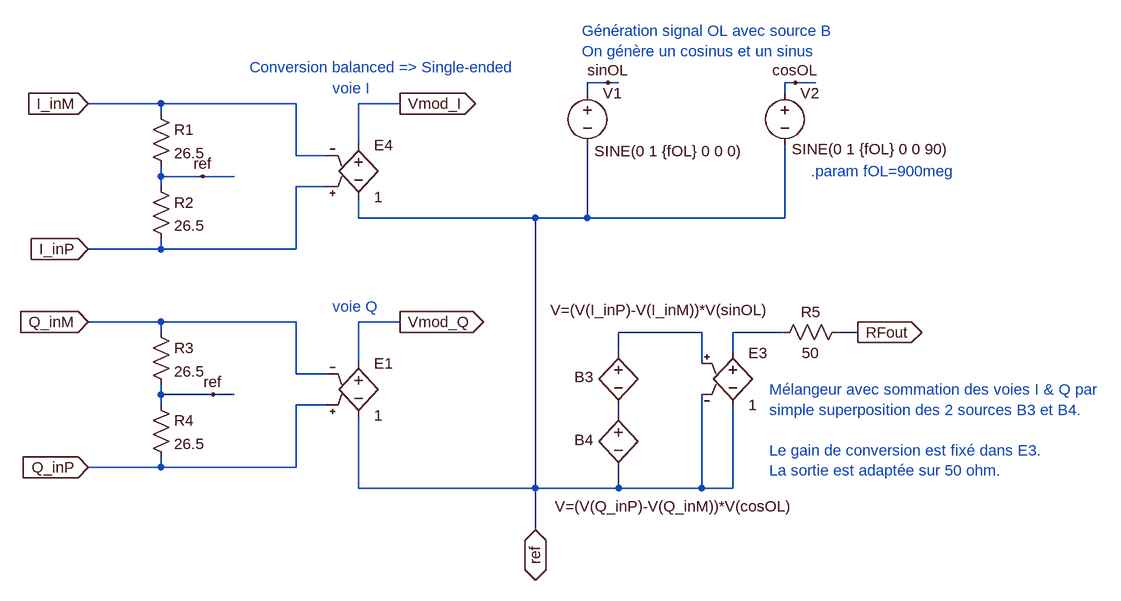
[diagram p0: schematic IQ_mixer.asc]
IQ_mixer.asc, the LTspice schematic file:
Version 4
SHEET 1 1824 724
WIRE 544 -304 512 -304
WIRE 560 -304 544 -304
WIRE 832 -304 816 -304
WIRE 864 -304 832 -304
WIRE 512 -288 512 -304
WIRE 816 -288 816 -304
WIRE -144 -272 -256 -272
WIRE 64 -272 -144 -272
WIRE 224 -272 160 -272
WIRE -144 -256 -144 -272
WIRE 160 -208 160 -272
WIRE 64 -192 64 -272
WIRE 112 -192 64 -192
WIRE -144 -160 -144 -176
WIRE -80 -160 -144 -160
WIRE -32 -160 -80 -160
WIRE -144 -144 -144 -160
WIRE 112 -144 64 -144
WIRE 160 -96 160 -128
WIRE 432 -96 160 -96
WIRE 512 -96 512 -208
WIRE 512 -96 432 -96
WIRE 816 -96 816 -208
WIRE 816 -96 512 -96
WIRE -144 -48 -144 -64
WIRE -144 -48 -256 -48
WIRE 64 -48 64 -144
WIRE 64 -48 -144 -48
WIRE -144 64 -256 64
WIRE 64 64 -144 64
WIRE 224 64 160 64
WIRE -144 80 -144 64
WIRE 688 80 560 80
WIRE 816 80 736 80
WIRE 928 80 896 80
WIRE 560 112 560 80
WIRE 736 112 736 80
WIRE 160 128 160 64
WIRE 688 128 688 80
WIRE 64 144 64 64
WIRE 112 144 64 144
WIRE -144 176 -144 160
WIRE -64 176 -144 176
WIRE -32 176 -64 176
WIRE -144 192 -144 176
WIRE 112 192 64 192
WIRE 560 208 560 192
WIRE -144 288 -144 272
WIRE -144 288 -256 288
WIRE 64 288 64 192
WIRE 64 288 -144 288
WIRE 160 320 160 208
WIRE 432 320 432 -96
WIRE 432 320 160 320
WIRE 560 320 560 288
WIRE 560 320 432 320
WIRE 688 320 688 176
WIRE 688 320 560 320
WIRE 736 320 736 192
WIRE 736 320 688 320
WIRE 432 384 432 320
FLAG -80 -160 ref
FLAG -64 176 ref
FLAG -256 -272 I_inM
IOPIN -256 -272 In
FLAG -256 -48 I_inP
IOPIN -256 -48 In
FLAG -256 64 Q_inM
IOPIN -256 64 In
FLAG -256 288 Q_inP
IOPIN -256 288 In
FLAG 224 -272 Vmod_I
IOPIN 224 -272 Out
FLAG 224 64 Vmod_Q
IOPIN 224 64 Out
FLAG 928 80 RFout
IOPIN 928 80 Out
FLAG 432 384 ref
IOPIN 432 384 BiDir
FLAG 544 -304 sinOL
FLAG 832 -304 cosOL
SYMBOL res -160 -272 R0
SYMATTR InstName R1
SYMATTR Value 26.5
SYMBOL res -160 -160 R0
SYMATTR InstName R2
SYMATTR Value 26.5
SYMBOL res -160 64 R0
SYMATTR InstName R3
SYMATTR Value 26.5
SYMBOL res -160 176 R0
SYMATTR InstName R4
SYMATTR Value 26.5
SYMBOL bv 560 96 R0
WINDOW 0 -68 53 Left 0
WINDOW 3 -105 -50 Left 0
SYMATTR InstName B3
SYMATTR Value V=(V(I_inP)-V(I_inM))*V(sinOL)
SYMBOL bv 560 192 R0
WINDOW 0 -68 54 Left 0
WINDOW 3 -98 156 Left 0
SYMATTR InstName B4
SYMATTR Value V=(V(Q_inP)-V(Q_inM))*V(cosOL)
SYMBOL e 736 96 R0
SYMATTR InstName E3
SYMATTR Value 1
SYMBOL res 912 64 R90
WINDOW 0 0 56 VBottom 0
WINDOW 3 32 56 VTop 0
SYMATTR InstName R5
SYMATTR Value 50
SYMBOL e2 160 -224 R0
SYMATTR InstName E4
SYMATTR Value 1
SYMBOL e2 160 112 R0
SYMATTR InstName E1
SYMATTR Value 1
SYMBOL voltage 512 -304 R0
WINDOW 3 11 105 Left 0
WINDOW 123 0 0 Left 0
WINDOW 39 0 0 Left 0
SYMATTR Value SINE(0 1 {fOL} 0 0 0)
SYMATTR InstName V1
SYMBOL voltage 816 -304 R0
WINDOW 3 11 102 Left 0
WINDOW 123 0 0 Left 0
WINDOW 39 0 0 Left 0
SYMATTR Value SINE(0 1 {fOL} 0 0 90)
SYMATTR InstName V2
TEXT -8 -328 Left 0 ;Conversion balanced => Single-ended
TEXT 120 -296 Left 0 ;voie I
TEXT 120 40 Left 0 ;voie Q
TEXT 504 -384 Left 0 ;Génération signal OL avec source B\nOn génère un cosinus et un sinus
TEXT 792 168 Left 0 ;Mélangeur avec sommation des voies I & Q par\nsimple superposition des 2 sources B3 et B4.\n \nLe gain de conversion est fixé dans E3.\nLa sortie est adaptée sur 50 ohm.
TEXT 856 -168 Left 0 ;.param fOL=900meg

The netlist it stands for:
* IQ_mixer.asc
R1 I_inM ref 26.5
R2 ref I_inP 26.5
R3 Q_inM ref 26.5
R4 ref Q_inP 26.5
B3 N001 N003 V=(V(I_inP)-V(I_inM))*V(sinOL)
B4 N003 ref V=(V(Q_inP)-V(Q_inM))*V(cosOL)
E3 N002 ref N001 ref 1
R5 RFout N002 50
E4 Vmod_I ref I_inP I_inM 1
E1 Vmod_Q ref Q_inP Q_inM 1
V1 sinOL ref SINE(0 1 {fOL} 0 0 0)
V2 cosOL ref SINE(0 1 {fOL} 0 0 90)
* Conversion balanced => Single-ended
* voie I
* voie Q
* Génération signal OL avec source B
* On génère un cosinus et un sinus
* Mélangeur avec sommation des voies I & Q par
* simple superposition des 2 sources B3 et B4.
* Le gain de conversion est fixé dans E3.
* La sortie est adaptée sur 50 ohm.
* .param fOL=900meg
.backanno
.end